# Altium schematic sheet 2 - ports.SchDoc
size A4
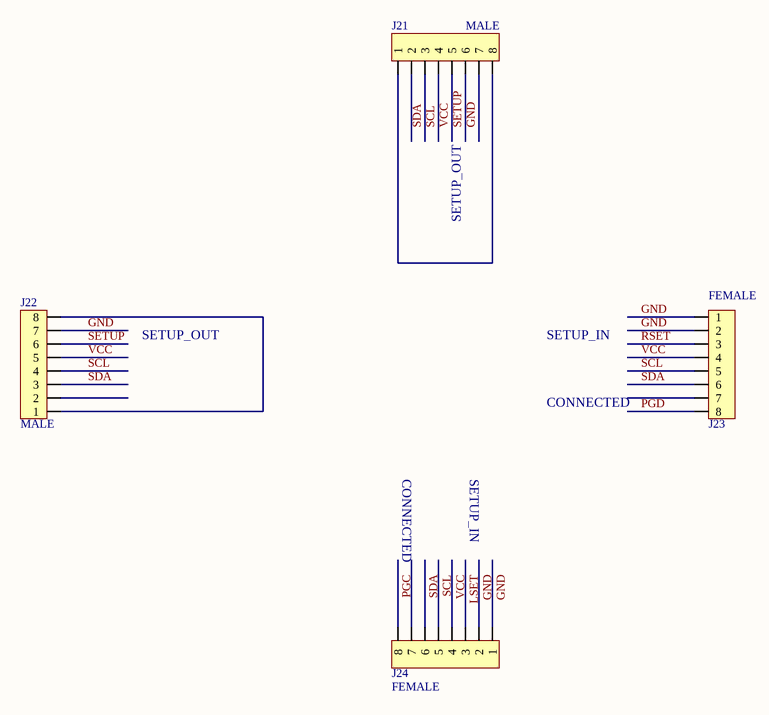
[diagram p0: 2 - ports.SchDoc]

## Parts
J21  MALE  [HDR1X8_2.54_180H]
J22  MALE  [HDR1X8_2.54_180H]
J23  FEMALE  [HDR1X8_2.54_180H]
J24  FEMALE  [HDR1X8_2.54_180H]

## Nets
GND: J21.7 J22.7 J23.1 J23.2 J24.1 J24.2
LSET: J24.3
PGC: J24.8
PGD: J23.8
RSET: J23.3
SCL: J21.4 J22.4 J23.5 J24.5
SDA: J21.3 J22.3 J23.6 J24.6
SETUP: J21.6 J22.6
VCC: J21.5 J22.5 J23.4 J24.4
NetJ21_1: J21.1 J21.8
NetJ22_1: J22.1 J22.8

Not connected (* = marked no-connect by the designer): J21 2; J22 2; J23 7; J24 7

## Notes on the sheet
- SETUP_OUT
- SETUP_IN
- CONNECTED

## Library data of the parts
J21-J24 = HDR1x8_2.54: Header